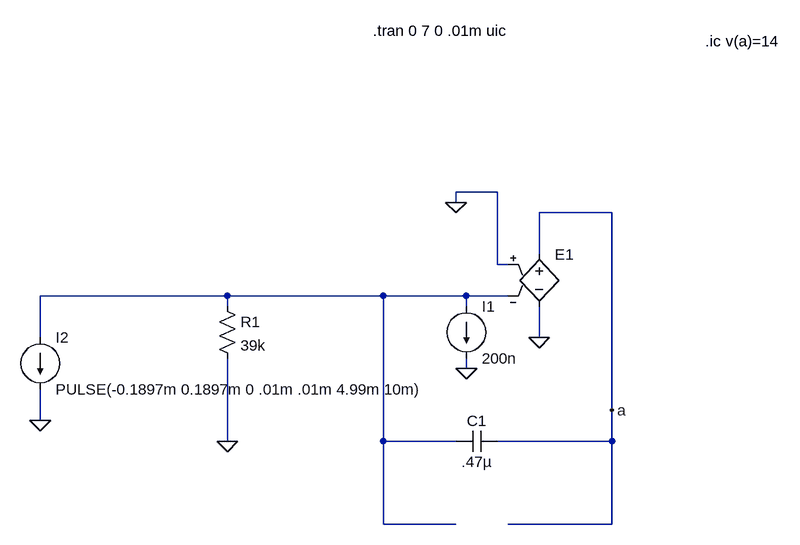
[diagram p0: schematic intideal2.asc]
intideal2.asc, the LTspice schematic file:
Version 4
SHEET 1 1748 680
WIRE 784 -16 720 -16
WIRE 720 0 720 -16
WIRE 960 16 848 16
WIRE 848 80 848 16
WIRE 784 96 784 -16
WIRE 800 96 784 96
WIRE 368 144 80 144
WIRE 608 144 368 144
WIRE 736 144 608 144
WIRE 800 144 736 144
WIRE 368 160 368 144
WIRE 736 160 736 144
WIRE 80 208 80 144
WIRE 848 208 848 160
WIRE 736 256 736 240
WIRE 960 320 960 16
WIRE 80 336 80 288
WIRE 368 368 368 240
WIRE 608 368 608 144
WIRE 720 368 608 368
WIRE 960 368 960 320
WIRE 960 368 784 368
WIRE 608 496 608 368
WIRE 720 496 608 496
WIRE 960 496 960 368
WIRE 960 496 800 496
FLAG 848 208 0
FLAG 80 336 0
FLAG 720 0 0
FLAG 960 320 a
FLAG 736 256 0
FLAG 368 368 0
SYMBOL e 848 64 R0
WINDOW 3 24 96 Invisible 2
SYMATTR Value table=(-100,-15)(-50u,-15)(50u,15)(100,15)
SYMATTR InstName E1
SYMBOL cap 784 352 R90
WINDOW 0 0 32 VBottom 2
WINDOW 3 32 32 VTop 2
SYMATTR InstName C1
SYMATTR Value .47µ
SYMBOL current 736 160 R0
WINDOW 123 0 0 Left 2
WINDOW 39 0 0 Left 2
SYMATTR InstName I1
SYMATTR Value 200n
SYMBOL current 80 208 R0
WINDOW 123 0 0 Left 2
WINDOW 39 0 0 Left 2
SYMATTR InstName I2
SYMATTR Value PULSE(-0.1897m 0.1897m 0 .01m .01m 4.99m 10m)
SYMBOL res 352 144 R0
SYMATTR InstName R1
SYMATTR Value 39k
TEXT 592 -264 Left 2 !.tran 0 7 0 .01m uic
TEXT 1104 -248 Left 2 !.ic v(a)=14

The netlist it stands for:
* intideal2.asc
E1 a 0 0 N001 table=(-100,-15)(-50u,-15)(50u,15)(100,15)
C1 a N001 .47µ
I1 N001 0 200n
I2 N001 0 PULSE(-0.1897m 0.1897m 0 .01m .01m 4.99m 10m)
R1 N001 0 39k
.tran 0 7 0 .01m uic
.ic v(a)=14
.backanno
.end